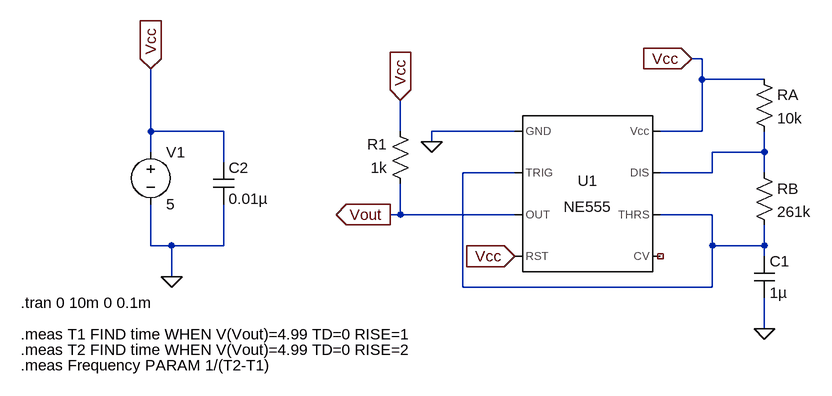
[diagram p0: schematic Bai5-3.asc]
Bai5-3.asc, the LTspice schematic file:
Version 4
SHEET 1 880 680
WIRE 352 -32 336 -32
WIRE 352 0 352 -32
WIRE 448 0 352 0
WIRE -496 80 -496 -16
WIRE -384 80 -496 80
WIRE -112 80 -112 32
WIRE 64 80 -64 80
WIRE 352 80 352 0
WIRE 352 80 288 80
WIRE -64 96 -64 80
WIRE -496 112 -496 80
WIRE 448 112 448 80
WIRE 448 112 368 112
WIRE -384 128 -384 80
WIRE 64 144 -16 144
WIRE 368 144 368 112
WIRE 368 144 288 144
WIRE 448 144 448 112
WIRE -112 208 -112 160
WIRE -112 208 -128 208
WIRE 64 208 -112 208
WIRE 368 208 288 208
WIRE -496 256 -496 192
WIRE -464 256 -496 256
WIRE -384 256 -384 192
WIRE -384 256 -464 256
WIRE 368 256 368 208
WIRE 448 256 448 224
WIRE 448 256 368 256
WIRE 448 272 448 256
WIRE -464 304 -464 256
WIRE -16 320 -16 144
WIRE 368 320 368 256
WIRE 368 320 -16 320
WIRE 448 384 448 336
FLAG -64 96 0
FLAG -128 208 Vout
IOPIN -128 208 Out
FLAG 448 384 0
FLAG -464 304 0
FLAG -496 -16 Vcc
IOPIN -496 -16 In
FLAG 336 -32 Vcc
IOPIN 336 -32 In
FLAG 64 272 Vcc
IOPIN 64 272 In
FLAG -112 32 Vcc
IOPIN -112 32 In
SYMBOL Misc\\NE555 176 176 R0
SYMATTR InstName U1
SYMBOL res 432 128 R0
SYMATTR InstName RB
SYMATTR Value 261k
SYMBOL res 432 -16 R0
SYMATTR InstName RA
SYMATTR Value 10k
SYMBOL cap 432 272 R0
SYMATTR InstName C1
SYMATTR Value 1µ
SYMBOL voltage -496 96 R0
WINDOW 123 0 0 Left 0
WINDOW 39 0 0 Left 0
SYMATTR InstName V1
SYMATTR Value 5
SYMBOL cap -400 128 R0
SYMATTR InstName C2
SYMATTR Value 0.01µ
SYMBOL res -96 176 R180
WINDOW 0 36 76 Left 2
WINDOW 3 36 40 Left 2
SYMATTR InstName R1
SYMATTR Value 1k
TEXT -696 344 Left 2 !.tran 0 10m 0 0.1m
TEXT -696 392 Left 2 !.meas T1 FIND time WHEN V(Vout)=4.99 TD=0 RISE=1
TEXT -696 416 Left 2 !.meas T2 FIND time WHEN V(Vout)=4.99 TD=0 RISE=2
TEXT -696 440 Left 2 !.meas Frequency PARAM 1/(T2-T1)

The netlist it stands for:
* Bai5-3.asc
XU1 0 N002 Vout Vcc NC_01 N002 N001 Vcc NE555  ; pins GND TRIG OUT RST CV THRS DIS Vcc
RB N001 N002 261k
RA Vcc N001 10k
C1 N002 0 1µ
V1 Vcc 0 5
C2 Vcc 0 0.01µ
R1 Vout Vcc 1k
.tran 0 10m 0 0.1m
.meas T1 FIND time WHEN V(Vout)=4.99 TD=0 RISE=1
.meas T2 FIND time WHEN V(Vout)=4.99 TD=0 RISE=2
.meas Frequency PARAM 1/(T2-T1)
.lib NE555.sub
.backanno
.end